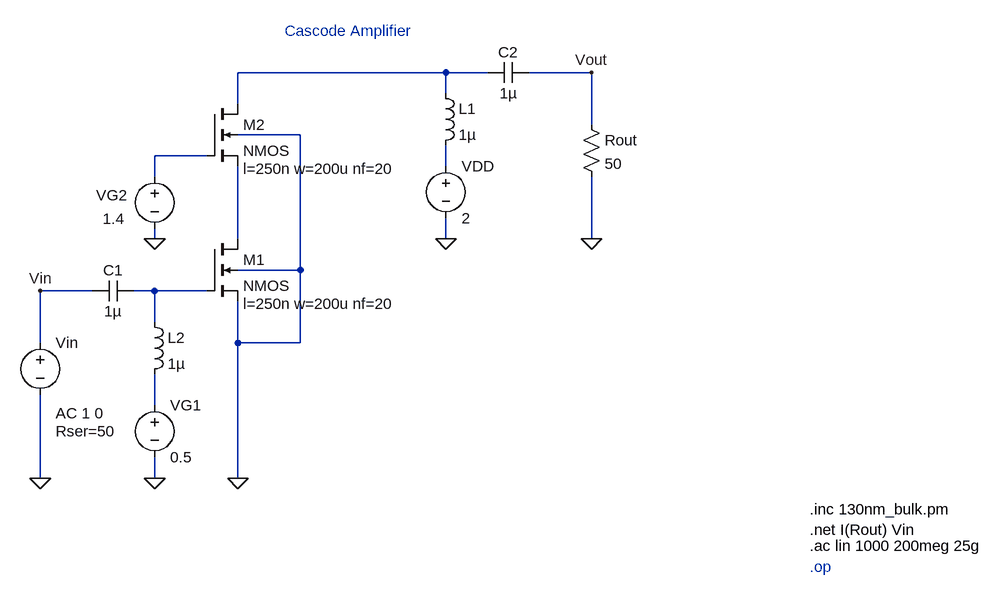
[diagram p0: schematic Cascode.asc]
Cascode.asc, the LTspice schematic file:
Version 4
SHEET 1 1360 680
WIRE 528 -208 208 -208
WIRE 592 -208 528 -208
WIRE 752 -208 656 -208
WIRE 528 -176 528 -208
WIRE 208 -160 208 -208
WIRE 752 -128 752 -208
WIRE 304 -112 208 -112
WIRE 160 -80 80 -80
WIRE 528 -64 528 -96
WIRE 80 -48 80 -80
WIRE 80 48 80 32
WIRE 208 48 208 -64
WIRE 528 48 528 16
WIRE 752 48 752 -48
WIRE 304 96 304 -112
WIRE 304 96 208 96
WIRE -16 128 -96 128
WIRE 80 128 48 128
WIRE 160 128 80 128
WIRE 80 176 80 128
WIRE -96 208 -96 128
WIRE 208 208 208 144
WIRE 304 208 304 96
WIRE 304 208 208 208
WIRE 80 304 80 256
WIRE -96 416 -96 288
WIRE 80 416 80 384
WIRE 208 416 208 208
FLAG -96 416 0
FLAG 80 416 0
FLAG 208 416 0
FLAG 528 48 0
FLAG 752 48 0
FLAG 80 48 0
FLAG -96 128 Vin
FLAG 752 -208 Vout
SYMBOL nmos4 160 48 R0
WINDOW 123 56 100 Left 2
SYMATTR Value2 l=250n w=200u nf=20
SYMATTR InstName M1
SYMBOL nmos4 160 -160 R0
WINDOW 123 56 100 Left 2
SYMATTR Value2 l=250n w=200u nf=20
SYMATTR InstName M2
SYMBOL ind 512 -192 R0
SYMATTR InstName L1
SYMATTR Value 1µ
SYMBOL ind 64 160 R0
SYMATTR InstName L2
SYMATTR Value 1µ
SYMBOL cap 656 -224 R90
WINDOW 0 0 32 VBottom 2
WINDOW 3 32 32 VTop 2
SYMATTR InstName C2
SYMATTR Value 1µ
SYMBOL cap 48 112 R90
WINDOW 0 0 32 VBottom 2
WINDOW 3 32 32 VTop 2
SYMATTR InstName C1
SYMATTR Value 1µ
SYMBOL res 736 -144 R0
SYMATTR InstName Rout
SYMATTR Value 50
SYMBOL voltage 80 288 R0
SYMATTR InstName VG1
SYMATTR Value 0.5
SYMBOL voltage 528 -80 R0
SYMATTR InstName VDD
SYMATTR Value 2
SYMBOL voltage -96 192 R0
WINDOW 123 24 124 Left 2
WINDOW 39 24 152 Left 2
SYMATTR Value2 AC 1 0
SYMATTR SpiceLine Rser=50
SYMATTR InstName Vin
SYMATTR Value ""
SYMBOL voltage 80 -64 R0
WINDOW 123 0 0 Left 0
WINDOW 39 0 0 Left 0
WINDOW 0 -90 45 Left 2
WINDOW 3 -80 81 Left 2
SYMATTR InstName VG2
SYMATTR Value 1.4
TEXT 1088 464 Left 2 !.inc 130nm_bulk.pm\n.net I(Rout) Vin
TEXT 1088 520 Left 2 !.ac lin 1000 200meg 25g
TEXT 280 -272 Left 2 ;Cascode Amplifier
TEXT 1088 552 Left 2 ;.op

The netlist it stands for:
* Cascode.asc
M1 N004 N005 0 0 NMOS l=250n w=200u nf=20
M2 N001 N002 N004 0 NMOS l=250n w=200u nf=20
L1 N001 N003 1µ
L2 N005 N006 1µ
C2 Vout N001 1µ
C1 N005 Vin 1µ
Rout Vout 0 50
VG1 N006 0 0.5
VDD N003 0 2
Vin Vin 0 AC 1 0 Rser=50
VG2 N002 0 1.4
.model NMOS NMOS
.model PMOS PMOS
.lib standard.mos
.inc 130nm_bulk.pm
.net I(Rout) Vin
.ac lin 1000 200meg 25g
* Cascode Amplifier
* .op
.backanno
.end